# Altium schematic sheet Mini_Comm_sch.SchDoc
size A3
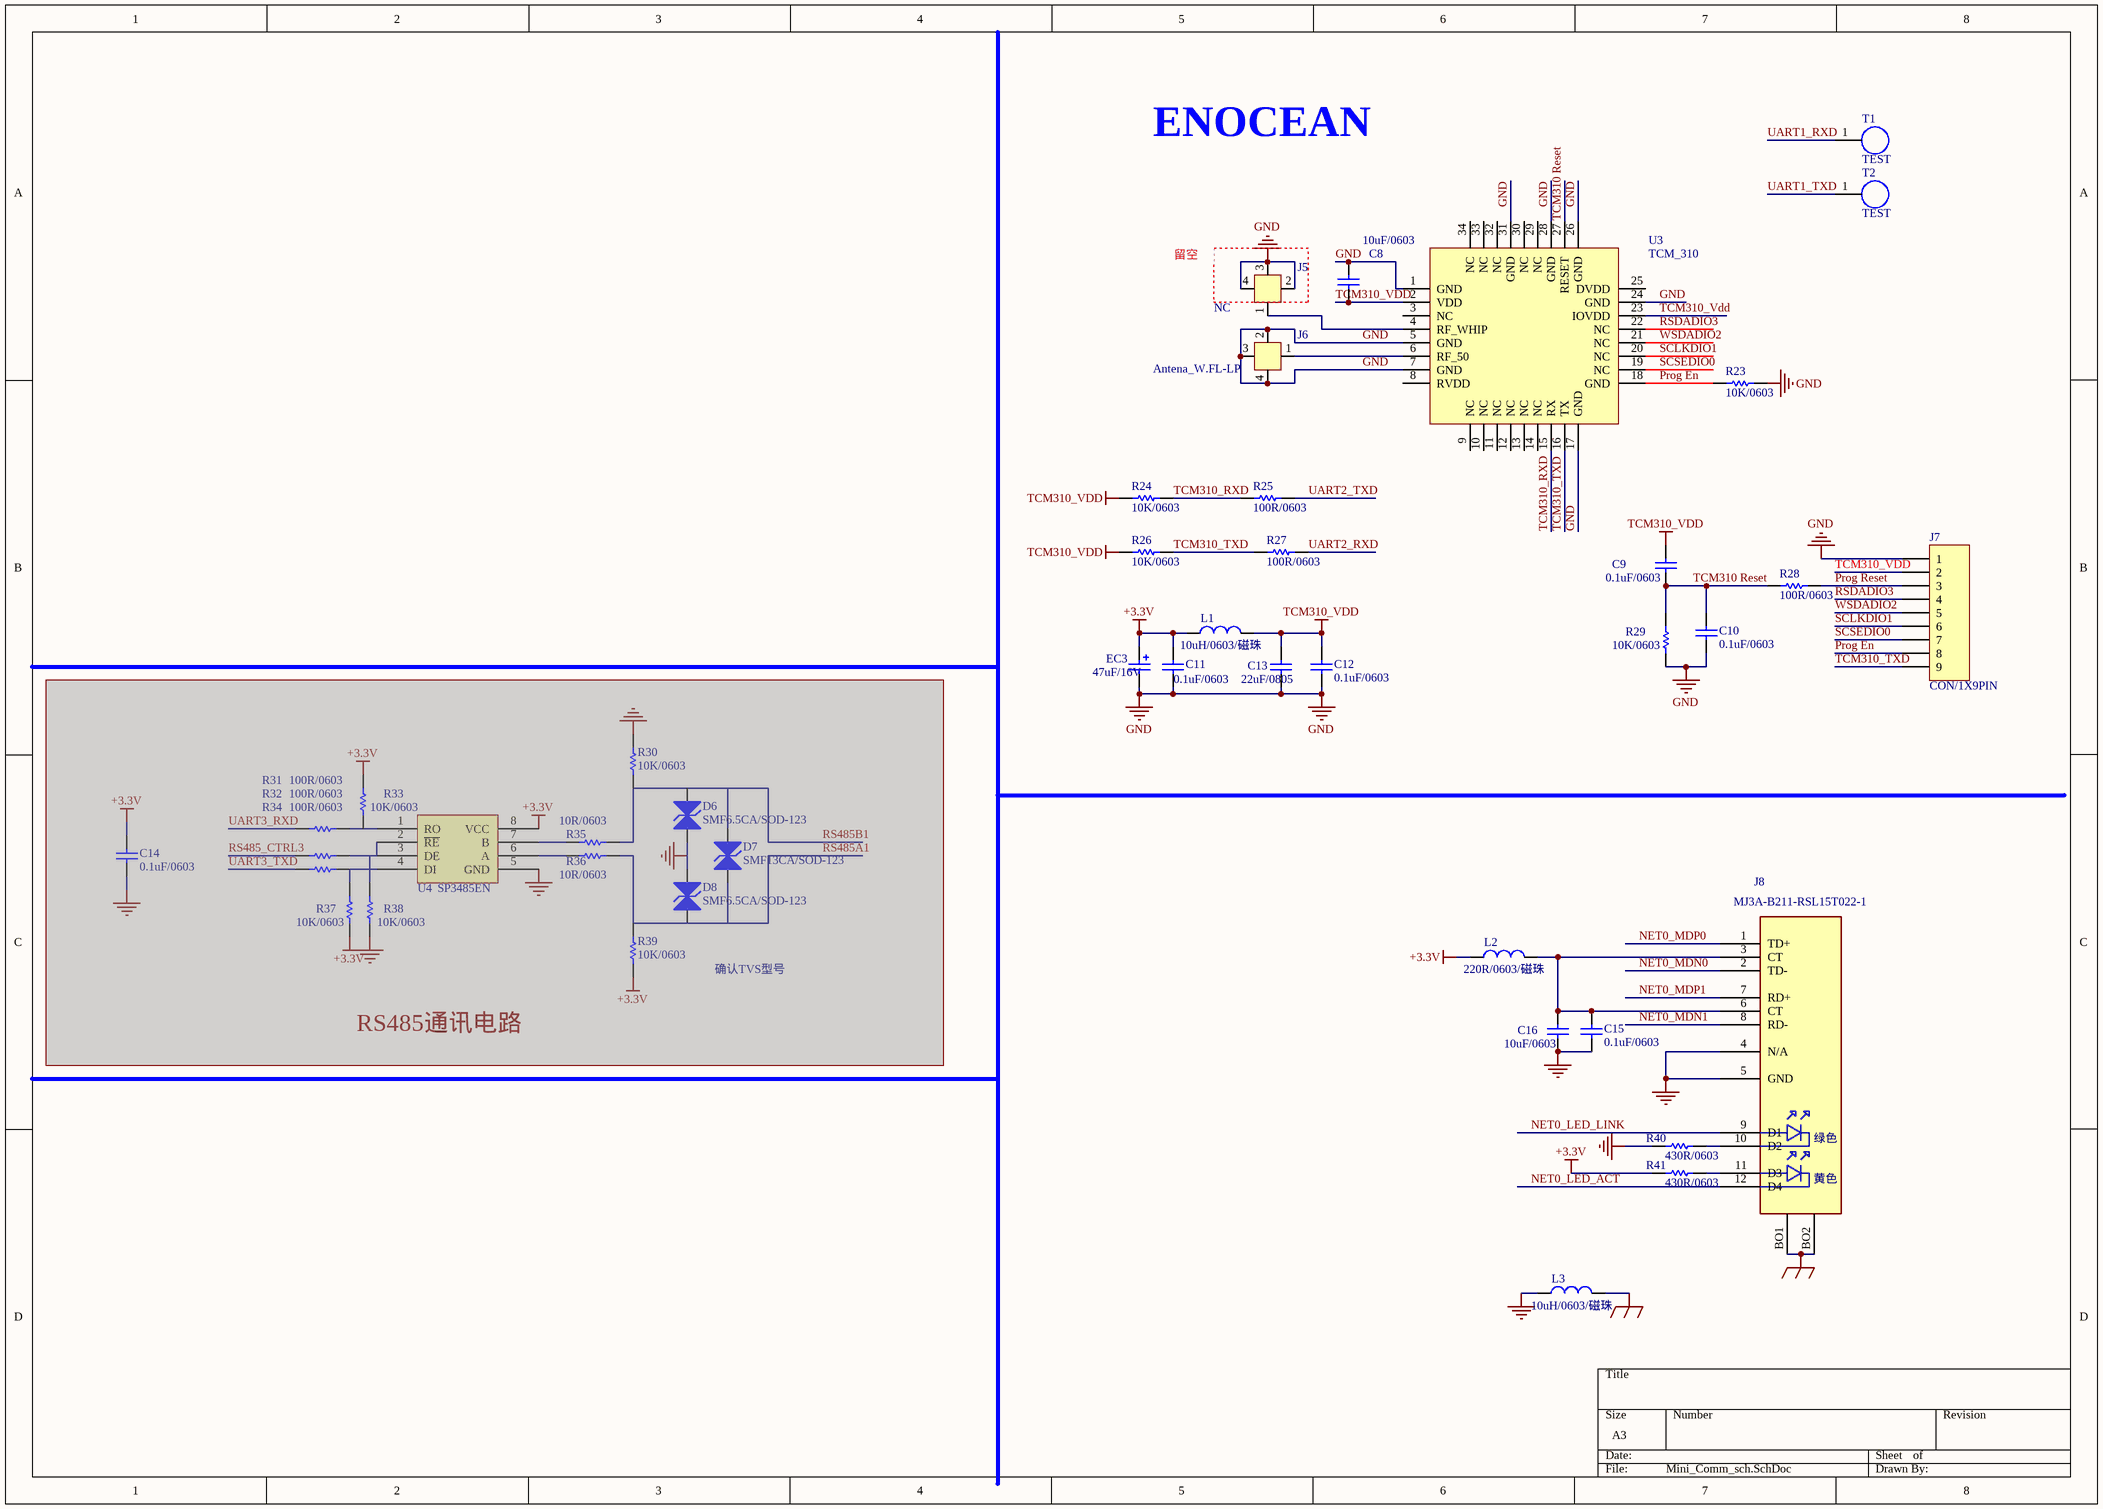
[diagram p0: Mini_Comm_sch.SchDoc]

## Parts
C8  10uF/0603  [CAP/SMT/0603C]
C9  0.1uF/0603  [CAP/SMT/0603C]
C10  0.1uF/0603  [CAP/SMT/0603C]
C11  0.1uF/0603  [CAP/SMT/0603C]
C12  0.1uF/0603  [CAP/SMT/0603C]
C13  22uF/0805  [CAP/SMT/0805C]
C14  0.1uF/0603  [CAP/SMT/0603C]  (masked out: inside a compile mask, not in the netlist)
C15  0.1uF/0603  [CAP/SMT/0603C]
C16  10uF/0603  [CAP/SMT/0603C]
D6  SMF6.5CA/SOD-123  [D/SMT/SOD123]  (masked out: inside a compile mask, not in the netlist)
D7  SMF13CA/SOD-123  [D/SMT/SOD123]  (masked out: inside a compile mask, not in the netlist)
D8  SMF6.5CA/SOD-123  [D/SMT/SOD123]  (masked out: inside a compile mask, not in the netlist)
EC3  47uF/16V  [CAP/SMT/47uF/16V]
J5  NC  [W.FL.LP-3MM]
J6  Antena_W.FL-LP  [W.FL.LP-3MM]
J7  CON/1X9PIN  [CON/DIP/1×9PIN/1.27MM]
J8  MJ3A-B211-RSL15T022-1  [RJ45-MJ3A-B211-RSL15T022-1]
L1  10uH/0603/磁珠  [0603R]
L2  220R/0603/磁珠  [0603R]
L3  10uH/0603/磁珠  [0603R]
R23  10K/0603  [0603R]
R24  10K/0603  [0603R]
R25  100R/0603  [0603R]
R26  10K/0603  [0603R]
R27  100R/0603  [0603R]
R28  100R/0603  [0603R]
R29  10K/0603  [0603R]
R30  10K/0603  [0603R]  (masked out: inside a compile mask, not in the netlist)
R31  100R/0603  [0603R]  (masked out: inside a compile mask, not in the netlist)
R32  100R/0603  [0603R]  (masked out: inside a compile mask, not in the netlist)
R33  10K/0603  [0603R]  (masked out: inside a compile mask, not in the netlist)
R34  100R/0603  [0603R]  (masked out: inside a compile mask, not in the netlist)
R35  10R/0603  [0603R]  (masked out: inside a compile mask, not in the netlist)
R36  10R/0603  [0603R]  (masked out: inside a compile mask, not in the netlist)
R37  10K/0603  [0603R]  (masked out: inside a compile mask, not in the netlist)
R38  10K/0603  [0603R]  (masked out: inside a compile mask, not in the netlist)
R39  10K/0603  [0603R]  (masked out: inside a compile mask, not in the netlist)
R40  430R/0603  [0603R]
R41  430R/0603  [0603R]
T1  TEST  [TEST]
T2  TEST  [TEST]
U3  TCM_310  [TCM310]
U4  SP3485EN  [SOIC-8]  (masked out: inside a compile mask, not in the netlist)

## Nets
+3.3V: C11.1 EC3.1 L1.1 L2.1 R41.2
EARTH: J8.BO1 J8.BO2 L3.2
GND: C8.2 C10.1 C11.2 C12.1 C13.1 C15.2 C16.1 EC3.2 J5.2(NC) J5.3(NC) J5.4(NC) J6.2(NC) J6.3(NC) J6.4(NC) J7.1 J8.4(N/A) J8.5(GND) L3.1 R23.1 R29.1 R40.2 U3.1(GND) U3.5(GND) U3.7(GND) U3.17(GND) U3.24(GND) U3.26(GND) U3.28(GND) U3.31(GND)
TCM310_Vdd: C8.1 C9.2 C12.2 C13.2 J7.2 L1.2 R24.2 R26.2 U3.2(VDD) U3.23(IOVDD)
NET0_LED_ACT: J8.12(D4)
NET0_LED_LINK: J8.9(D1)
NET0_MDN0: J8.2(TD-)
NET0_MDN1: J8.8(RD-)
NET0_MDP0: J8.1(TD+)
NET0_MDP1: J8.7(RD+)
Prog En: J7.8 R23.2 U3.18(GND)
Prog Reset: J7.3 R28.1
RSDADIO3: J7.4 U3.22(NC)
SCLKDIO1: J7.6 U3.20(NC)
SCSEDIO0: J7.7 U3.19(NC)
TCM310 Reset: C9.1 C10.2 R28.2 R29.2 U3.27(RESET)
TCM310_RXD: R24.1 R25.2 U3.15(RX)
TCM310_TXD: J7.9 R26.1 R27.2 U3.16(TX)
UART1_RXD: T1.1
UART1_TXD: T2.1
UART2_RXD: R27.1
UART2_TXD: R25.1
WSDADIO2: J7.5 U3.21(NC)
NetC15_1: C15.1 C16.2 J8.3(CT) J8.6(CT) L2.2
NetJ5_1: J5.1(NC) U3.4(RF_WHIP)
NetJ6_1: J6.1(NC) U3.6(RF_50)
NetJ8_10: J8.10(D2) R40.1
NetJ8_11: J8.11(D3) R41.1

Not connected (* = marked no-connect by the designer): U3 3(NC) 8(RVDD) 9(NC) 10(NC) 11(NC) 12(NC) 13(NC) 14(NC) 25(DVDD) 29(NC) 30(NC) 32(NC) 33(NC) 34(NC)

## Notes on the sheet
- ENOCEAN
- (near J5) 留空
- 确认TVS型号
- (in symbol RJ45B-48F-01GY2DPL2NL) 绿色; 黄色

## Library data of the parts
C8-C12 C14-C16 = CAP/CAP/SMT/0603C
C13 = CAP/CAP/SMT/0805C
D6-D8 = D/TVS/SMT/SMF13CA/SOD-123
EC3 = CAP/AEC/SMT/47uF/16V
J5 J6 = Antena
J7 = CON/DIP/1X9PIN/1.27MM
J8 = RJ45B-48F-01GY2DPL2NL: RJ45 + MAG
L1-L3 = INDUCTOR1
R23-R41 = RES/RES/SMT/0603
U4 = SP485EN: MAXIM: *; PackageReference: SOIC8
U3 = TCM_310: PackageReference: *